# EAGLE design MSX OPL4 Wozblaster (EAGLE 6.1)
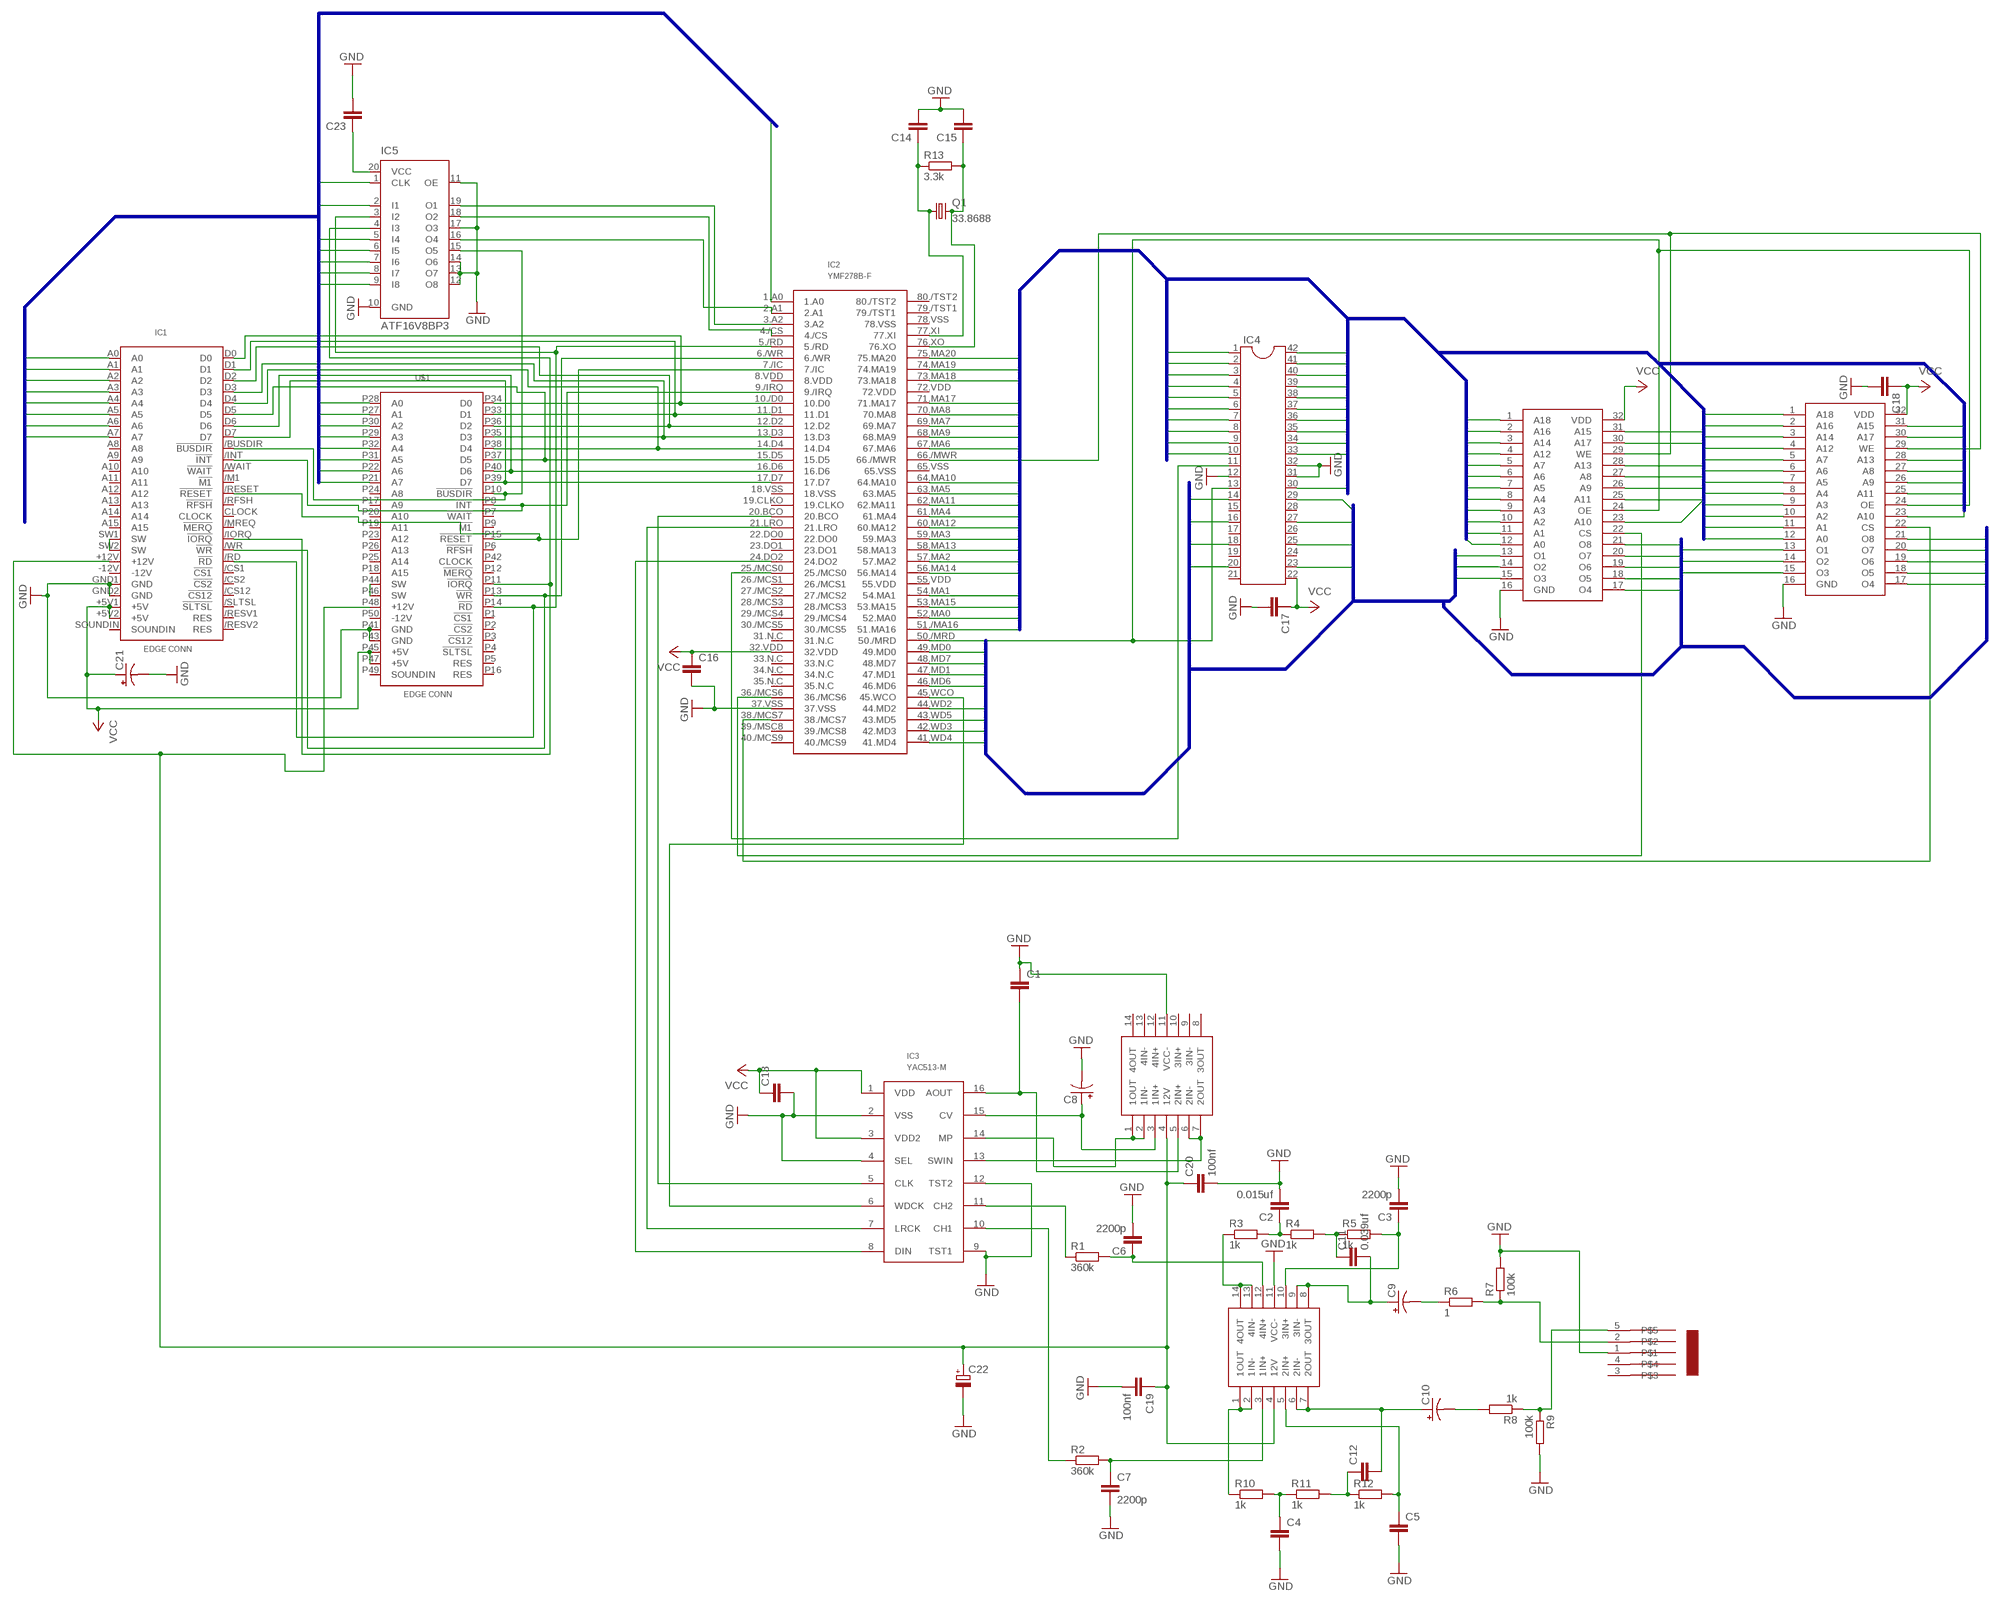
[diagram p0: schematic, sheet 1]

## Parts
C1  C2.5/2  [C2.5-2]
C2  0.015uf  C2.5/2  [C2.5-2]
C3  2200p  C2.5/2  [C2.5-2]
C4  C2.5/2  [C2.5-2]
C5  C2.5/2  [C2.5-2]
C6  2200p  C2.5/2  [C2.5-2]
C7  2200p  C2.5/2  [C2.5-2]
C8  CPOL-USE2.5-5  [E2,5-5]
C9  CPOL-USE2.5-5  [E2,5-5]
C10  CPOL-USE2.5-5  [E2,5-5]
C11  0.039uf  C2.5/2  [C2.5-2]
C12  C2.5/2  [C2.5-2]
C13  C2.5/2  [C2.5-2]
C14  C2.5/2  [C2.5-2]
C15  C2.5/2  [C2.5-2]
C16  C2.5/2  [C2.5-2]
C17  C2.5/2  [C2.5-2]
C18  C2.5/2  [C2.5-2]
C19  100nf  C2.5/2  [C2.5-2]
C20  100nf  C2.5/2  [C2.5-2]
C21  CPOL-USE2.5-5  [E2,5-5]
C22  CPOL-EUD/7343-31R  [D/7343-31R]
C23  C2.5/2  [C2.5-2]
IC1  OPL4_10X10  [OPL410X10]
IC2  YMF278B-F  [80-QFP]
IC3  YAC513-M  [16SOP]
IC4  DIL42  [DIL42]
IC5  ATF16V8BP3  [DIL20]
Q1  33.8688  CRYSTALHC49S  [HC49/S]
R1  360k  R-EU_0204/7  [0204/7]
R2  360k  R-EU_0204/7  [0204/7]
R3  1k  R-EU_0204/7  [0204/7]
R4  1k  R-EU_0204/7  [0204/7]
R5  1k  R-EU_0204/7  [0204/7]
R6  1  R-EU_0204/7  [0204/7]
R7  100k  R-EU_0204/7  [0204/7]
R8  1k  R-EU_0204/7  [0204/7]
R9  100k  R-EU_0204/7  [0204/7]
R10  1k  R-EU_0204/7  [0204/7]
R11  1k  R-EU_0204/7  [0204/7]
R12  1k  R-EU_0204/7  [0204/7]
R13  3.3k  R-EU_0204/7  [0204/7]
U$1  50PINCONN  [MSX50PINHEADER]
U$2  LF347SO14  [SO14-2]
U$3  LF347SO14  [SO14-2]
U$4  SRAM4MBIT  [SOP32L]
U$5  SRAM4MBIT  [SOP32L]
U$6  MSXJACK  [1501_06]

## Nets
+12V: C19.1 C20.1 C22.+ IC1.+12V U$1.P48(+12V) U$2.4(12V) U$3.4(12V)
A0: IC2.52.MA0 IC4.30(MA0) U$4.12(A0) U$5.12(A0)
A1: IC2.54.MA1 IC4.10(MA1) U$4.11(A1) U$5.11(A1)
A2: IC2.57.MA2 IC4.9(MA2) U$4.10(A2) U$5.10(A2)
A3: IC2.59.MA3 IC4.8(MA3) U$4.9(A3) U$5.9(A3)
A4: IC2.61.MA4 IC4.7(MA4) U$4.8(A4) U$5.8(A4)
A5: IC2.63.MA5 IC4.6(MA5) U$4.7(A5) U$5.7(A5)
A6: IC2.67.MA6 IC4.5(MA6) U$4.6(A6) U$5.6(A6)
A7: IC2.69.MA7 IC4.4(MA7) U$4.5(A7) U$5.5(A7)
A8: IC2.70.MA8 IC4.3(MA8) U$4.27(A8) U$5.27(A8)
A9: IC2.68.MA9 IC4.41(MA9) U$4.26(A9) U$5.26(A9)
A10: IC2.64.MA10 IC4.40(MA10) U$4.23(A10) U$5.23(A10)
A11: IC2.62.MA11 IC4.39(MA11) U$4.25(A11) U$5.25(A11)
A12: IC2.60.MA12 IC4.38(MA12) U$4.4(A12) U$5.4(A12)
A13: IC2.58.MA13 IC4.37(MA13) U$4.28(A13) U$5.28(A13)
A14: IC2.56.MA14 IC4.36(MA14) U$4.3(A14) U$5.3(A14)
A15: IC2.53.MA15 IC4.35(MA15) U$4.31(A15) U$5.31(A15)
A16: IC2.51./MA16(51.MA16) IC4.34(MA16) U$4.2(A16) U$5.2(A16)
A17: IC2.71.MA17 IC4.33(MA17) U$4.30(A17) U$5.30(A17)
A18: IC2.73.MA18 IC4.2(MA18) U$4.1(A18) U$5.1(A18)
A19: IC2.74.MA19 IC4.1(MA19)
A20: IC2.75.MA20 IC4.42(MA20)
AA0: IC1.A0 IC2.1.A0 U$1.P28(A0)
AA1: IC1.A1 IC5.9(I8) U$1.P27(A1)
AA2: IC1.A2 IC5.2(I1) U$1.P30(A2)
AA3: IC1.A3 IC5.7(I6) U$1.P29(A3)
AA4: IC1.A4 IC5.6(I5) U$1.P32(A4)
AA5: IC1.A5 IC5.5(I4) U$1.P31(A5)
AA6: IC1.A6 IC5.1(CLK) U$1.P22(A6)
AA7: IC1.A7 IC5.8(I7) U$1.P21(A7)
GND: C1.1 C2.2 C3.2 C4.2 C5.2 C6.2 C7.2 C8.- C13.2 C14.2 C15.2 C16.2 C17.2 C18.2 C19.2 C20.2 C21.- C22.- C23.2 IC1.GND1(GND) IC1.GND2(GND) IC2.37.VSS IC3.2(VSS) IC3.4(SEL) IC3.9(TST1) IC3.12(TST2) IC4.12(VSS) IC4.31(GND1) IC4.32(GND) IC5.10(GND) IC5.11(OE) IC5.12(O8) IC5.13(O7) IC5.14(O6) IC5.17(O3) R7.2 R9.2 U$1.P41(GND) U$1.P43(GND) U$2.11(VCC-) U$3.11(VCC-) U$4.16(GND) U$5.16(GND) U$6.1
MD0: IC2.49.MD0 IC4.14(MD0) U$4.13(O1) U$5.13(O1)
MD1: IC2.47.MD1 IC4.16(MD1) U$4.14(O2) U$5.14(O2)
MD2: IC2.44.WD2(44.MD2) IC4.18(MD2) U$4.15(O3) U$5.15(O3)
MD3: IC2.42.WD3(42.MD3) IC4.20(MD3) U$4.17(O4) U$5.17(O4)
MD4: IC2.41.WD4(41.MD4) IC4.23(MD4) U$4.18(O5) U$5.18(O5)
MD5: IC2.43.WD5(43.MD5) IC4.25(MD5) U$4.19(O6) U$5.19(O6)
MD6: IC2.46.MD6 IC4.27(MD6) U$4.20(O7) U$5.20(O7)
MD7: IC2.48.MD7 IC4.29(MD7) U$4.21(O8) U$5.21(O8)
N$1: IC1.D0 IC2.10./D0(10.D0) U$1.P34(D0)
N$2: IC1.D1 IC2.11.D1 U$1.P33(D1)
N$3: IC1.D2 IC2.12.D2 U$1.P36(D2)
N$4: IC1.D3 IC2.13.D3 U$1.P35(D3)
N$5: IC1.D4 IC2.14.D4 U$1.P38(D4)
N$6: IC1.D5 IC2.15.D5 U$1.P37(D5)
N$7: IC1.D6 IC2.16.D6 U$1.P40(D6)
N$8: IC1.D7 IC2.17.D7 U$1.P39(D7)
N$9: IC1./RD(!RD) IC2.5./RD IC5.3(I2) U$1.P14(!RD)
N$10: IC1./IORQ(!IORQ) IC5.4(I3) U$1.P11(!IORQ)
N$11: IC2.3.A2 IC5.19(O1)
N$12: IC2.4./CS IC5.18(O2)
N$13: IC2.2.A1 IC5.16(O4)
N$14: IC1./BUSDIR(!BUSDIR) IC5.15(O5) U$1.P10(!BUSDIR)
N$15: C1.2 IC3.16(AOUT) U$2.5(2IN+)
N$16: IC3.14(MP) U$2.1(1OUT) U$2.2(1IN-)
N$17: IC3.11(CH2) R1.1
N$18: C6.1 R1.2 U$3.12(4IN+)
N$19: R3.1 U$3.13(4IN-) U$3.14(4OUT)
N$20: C2.1 R3.2 R4.1
N$21: C11.1 R4.2 R5.1
N$22: C3.1 R5.2 U$3.10(3IN+)
N$23: C9.+ C11.2 U$3.8(3OUT) U$3.9(3IN-)
N$24: C10.- R8.2
N$25: R6.2 R7.1 U$6.2
N$26: C7.1 R2.2 U$3.3(1IN+)
N$27: R10.1 U$3.1(1OUT) U$3.2(1IN-)
N$28: C4.1 R10.2 R11.1
N$29: C12.1 R11.2 R12.1
N$30: C5.1 R12.2 U$3.5(2IN+)
N$31: C10.+ C12.2 U$3.6(2IN-) U$3.7(2OUT)
N$32: C9.- R6.1
N$33: R8.1 R9.1 U$6.5
N$34: IC3.10(CH1) R2.1
N$35: C8.+ IC3.15(CV) U$2.3(1IN+)
N$36: IC3.13(SWIN) U$2.6(2IN-) U$2.7(2OUT)
N$37: IC2.20.BCO IC3.5(CLK)
N$38: IC2.45.WCO IC3.6(WDCK)
N$39: IC2.21.LRO IC3.7(LRCK)
N$40: IC2.24.DO2 IC3.8(DIN)
N$41: C15.1 IC2.76.XO Q1.2 R13.2
N$42: C14.1 IC2.77.XI Q1.1 R13.1
N$43: IC2.25./MCS0 IC4.11(MCS0)
N$44: IC2.50./MRD IC4.13(MRD) U$4.24(OE) U$5.24(OE)
N$45: IC2.36./MCS6 U$4.22(CS)
N$46: IC2.38./MCS7 U$5.22(CS)
N$47: IC2.66./MWR U$4.29(WE) U$5.29(WE)
N$48: IC1.SW1(SW) IC1.SW2(SW)
N$49: U$1.P44(SW) U$1.P46(SW)
N$50: IC1./WR(!WR) IC2.6./WR U$1.P13(!WR)
N$51: IC1./INT(!INT) IC2.9./IRQ U$1.P8(!INT)
N$52: IC1./RESET(!RESET) IC2.7./IC U$1.P15(!RESET)
N$54: C23.1 IC5.20(VCC)
VCC: C13.1 C16.1 C17.1 C18.1 C21.+ IC1.+5V1(+5V) IC1.+5V2(+5V) IC2.32.VDD IC3.1(VDD) IC3.3(VDD2) IC4.22(VDD) U$1.P45(+5V) U$1.P47(+5V) U$4.32(VDD) U$5.32(VDD)
Unconnected: IC1.-12V IC1./CS1(!CS1) IC1./CS2(!CS2) IC1./CS12(!CS12) IC1./M1(!M1) IC1./MREQ(!MERQ) IC1./RESV1(RES) IC1./RESV2(RES) IC1./RFSH(!RFSH) IC1./SLTSL(!SLTSL) IC1./WAIT(!WAIT) IC1.A8 IC1.A9 IC1.A10 IC1.A11 IC1.A12 IC1.A13 IC1.A14 IC1.A15 IC1.CLOCK IC1.SOUNDIN IC2.8.VDD IC2.18.VSS IC2.19.CLKO IC2.22.DO0 IC2.23.DO1 IC2.26./MCS1 IC2.27./MCS2 IC2.28./MCS3 IC2.29./MCS4 IC2.30./MCS5 IC2.31.N.C IC2.33.N.C IC2.34.N.C IC2.35.N.C IC2.39./MSC8(39./MCS8) IC2.40./MCS9 IC2.55.VDD IC2.65.VSS IC2.72.VDD IC2.78.VSS IC2.79./TST1 IC2.80./TST2 IC4.15 IC4.17 IC4.19 IC4.21 IC4.24 IC4.26 IC4.28 U$1.P1(!CS1) U$1.P2(!CS2) U$1.P3(!CS12) U$1.P4(!SLTSL) U$1.P5(RES) U$1.P6(!RFSH) U$1.P7(!WAIT) U$1.P9(!M1) U$1.P12(!MERQ) U$1.P16(RES) U$1.P17(A9) U$1.P18(A15) U$1.P19(A11) U$1.P20(A10) U$1.P23(A12) U$1.P24(A8) U$1.P25(A14) U$1.P26(A13) U$1.P42(CLOCK) U$1.P49(SOUNDIN) U$1.P50(-12V) U$2.8(3OUT) U$2.9(3IN-) U$2.10(3IN+) U$2.12(4IN+) U$2.13(4IN-) U$2.14(4OUT) U$6.3 U$6.4

## Buses
A[0..20]
MD[0..7]
AA[0..15]

## Library data of the parts
C1-C7 C11-C20 C23 = capacitor-wima MSX:C: CAPACITOR naming: grid - package width
C8-C10 C21 = rcl:CPOL-US: POLARIZED CAPACITOR, American symbol
C22 = rcl:CPOL-EU: POLARIZED CAPACITOR, European symbol
IC1 = msx-con:OPL4_10X10
IC2 = Yamaha YMF278B-F:YMF278B-F: OPL4
IC3 = OPL4:YAC513-M
IC4 = ic-package OPL4 10x20:DIL42: Dual In Line
IC5 = atmel OPL4 10x20:ATF16V8B: High perfomance CMOS (electrically erasable) programmable logic device (PLD) ABLE-Atmel-ABEL - P18V8R, P16V8C, P16V8AS, P17V8 COPL Atmel-WinCUPL - G16V8MS, G16V8MA, G16V8AS, G16V8 LOG/IC - GAL16V8_R, GAL16V8_G7, GAL16V8_C), GAL16V8 Tango-PLD - G16V8R, G16V8C, G16V8AS, G16V8 Source: http://www.atmel.com/dyn/resources/prod_documents/DOC0364.PDF; MPN: ATF16V8CZ-15PU; OC_FARNELL: 1551768; OC_NEWARK: 94M6254
Q1 = crystal:CRYSTAL: CRYSTAL; OC_FARNELL: 1667008; OC_NEWARK: unknown
R1-R13 = resistor:R-EU_: RESISTOR, European symbol
U$1 = MSX-50 pin BUS HEADER:50PINCONN
U$2 U$3 = Texas LF347:LF347SO14
U$4 U$5 = ref-packages SRAM SO 32:SRAM4MBIT
U$6 = con-lumberg MSX:MSXJACK

## Board
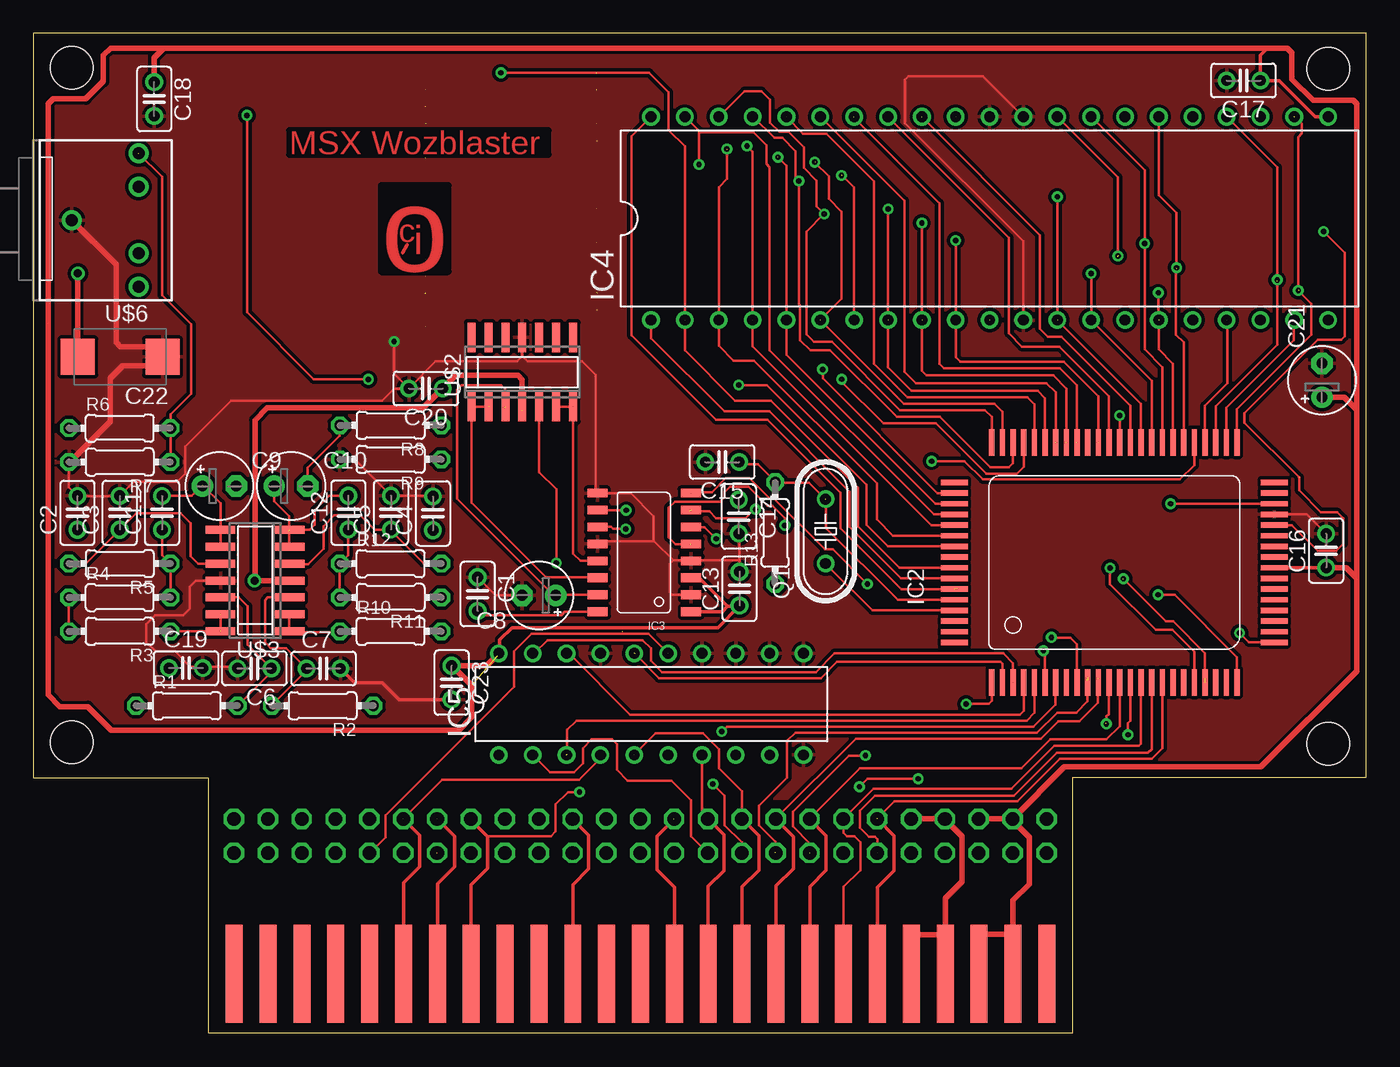
[diagram p1: board, top side]
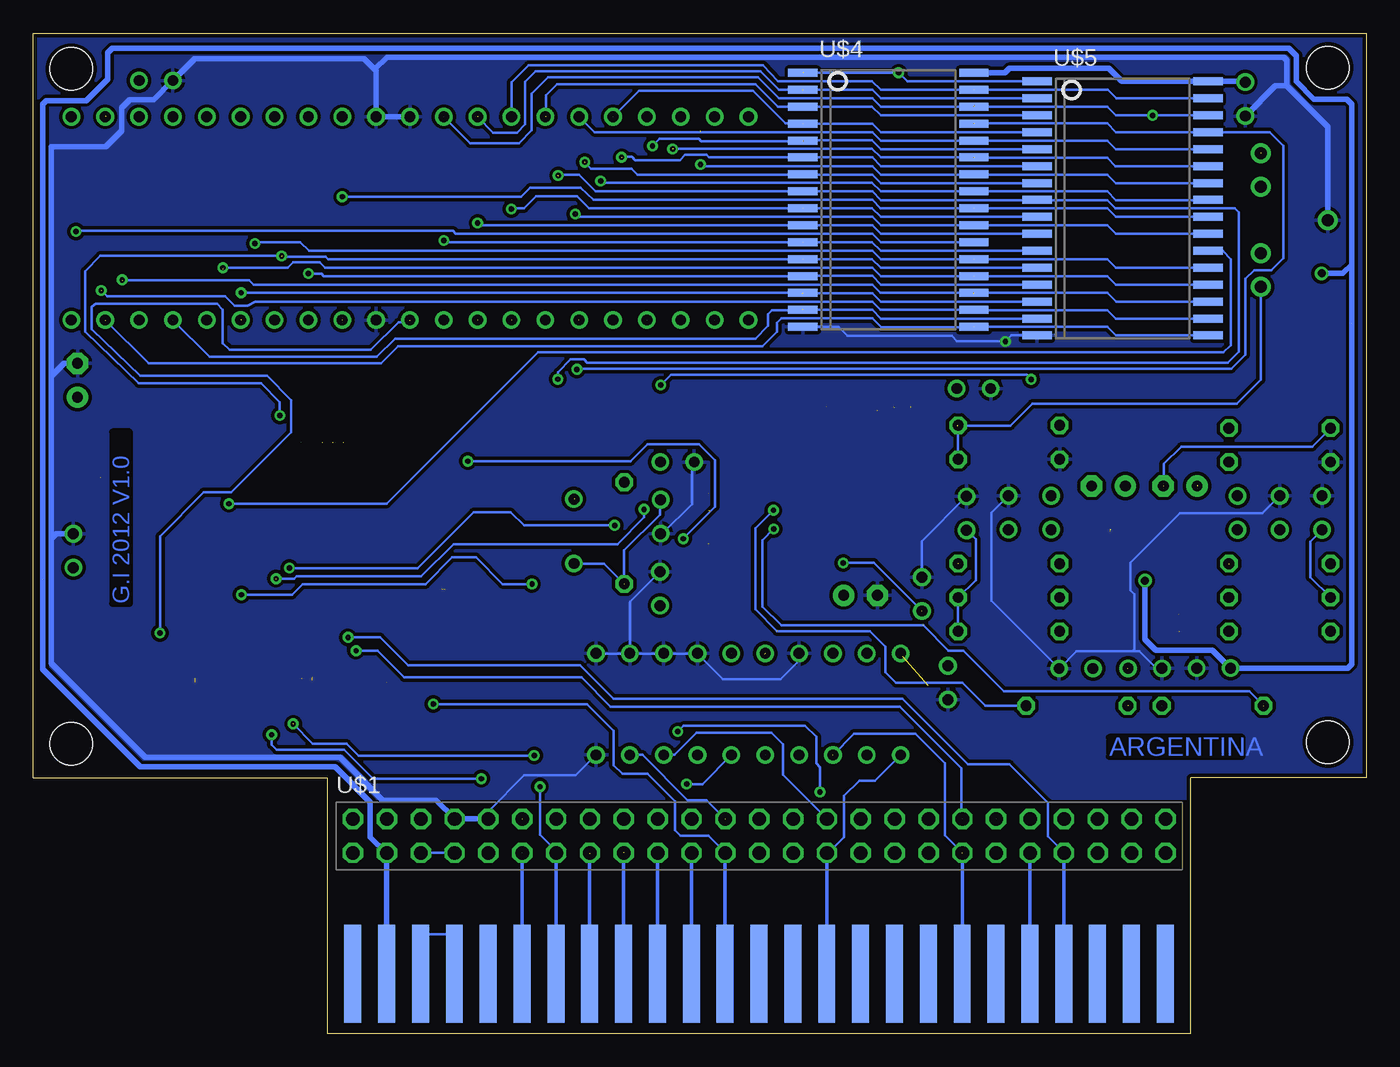
[diagram p2: board, bottom side, seen from below]

Size 100 x 75 mm. Coordinates in mm from the lower left corner, seen from the top.
Copper layers (1*16): Top 0.035mm / dielectric 1.5mm / Bottom 0.035mm
Design rules: minimum track width 0.2mm, minimum drill 0.29mm, track to track 8mil, track to pad 8mil, pad to pad 8mil, via to via 8mil, smd to smd 8mil, copper to edge 12mil, drill to drill 8mil, minimum pad ring 10mil, minimum via ring 8mil, stop-mask expansion 4mil, vias tented up to drill 0mil, thermal gap 10mil

### Footprints (pad centres in the part's own frame; a part is rotated, then mirrored left to right if it is on the bottom)
C2.5-2 = drill 0.813 pad 1.27: 1 -1.27,0; 2 1.27,0
E2,5-5 = drill 0.813 pad 1.6: + -1.27,0 | drill 0.813 pad 1.6 octagon: - 1.27,0
D/7343-31R = smd 2.55 x 2.7: + 3.175,0; - -3.175,0
OPL410X10 = smd 1.27 x 7.32 bottom: +5V1 -24.13,-32.362; +5V2 -21.59,-32.362; /CS1 34.29,-32.362; /CS12 31.75,-32.362; /IORQ 21.59,-32.362; /M1 24.13,-32.362; /RESET 16.51,-32.362; /RESV2 29.21,-32.362; /WAIT 26.67,-32.362; /WR 19.05,-32.362; A1 1.27,-32.362; A3 -1.27,-32.362; A5 -3.81,-32.362; A7 8.89,-32.362; A9 13.97,-32.362; A11 11.43,-32.362; A12 6.35,-32.362; A14 3.81,-32.362; D1 -6.35,-32.362; D3 -8.89,-32.362; D5 -11.43,-32.362; D7 -13.97,-32.362; GND1 -19.05,-32.362; GND2 -16.51,-32.362; SOUNDIN -26.67,-32.362 | smd 1.27 x 7.32: +12V -24.13,-32.362; -12V -26.67,-32.362; /BUSDIR 24.13,-32.362; /CS2 34.29,-32.362; /INT 26.67,-32.362; /MREQ 21.59,-32.362; /RD 19.05,-32.362; /RESV1 16.51,-32.362; /RFSH 29.21,-32.362; /SLTSL 31.75,-32.362; A0 1.27,-32.362; A2 -1.27,-32.362; A4 -3.81,-32.362; A6 8.89,-32.362; A8 6.35,-32.362; A10 11.43,-32.362; A13 3.81,-32.362; A15 13.97,-32.362; CLOCK -16.51,-32.362; D0 -6.35,-32.362; D2 -8.89,-32.362; D4 -11.43,-32.362; D6 -13.97,-32.362; SW1 -19.05,-32.362; SW2 -21.59,-32.362 | hole 3.2: -47.8,-15.1; 46.5,-15; -47.8,35.5; 46.5,35.6
80-QFP = smd 0.4 x 2: 1.A0 -9.1,-9.3; 2.A1 -8.3,-9.3; 3.A2 -7.5,-9.3; 4./CS -6.7,-9.3; 5./RD -5.9,-9.3; 6./WR -5.1,-9.3; 7./IC -4.3,-9.3; 8.VDD -3.5,-9.3; 9./IRQ -2.7,-9.3; 10./D0 -1.9,-9.3; 11.D1 -1.1,-9.3; 12.D2 -0.3,-9.3; 13.D3 0.5,-9.3; 14.D4 1.3,-9.3; 15.D5 2.1,-9.3; 16.D6 2.9,-9.3; 17.D7 3.7,-9.3; 18.VSS 4.5,-9.3; 19.CLKO 5.3,-9.3; 20.BCO 6.1,-9.3; 21.LRO 6.9,-9.3; 22.DO0 7.7,-9.3; 23.DO1 8.5,-9.3; 24.DO2 9.3,-9.3; 41.WD4 9.3,8.7; 42.WD3 8.5,8.7; 43.WD5 7.7,8.7; 44.WD2 6.9,8.7; 45.WCO 6.1,8.7; 46.MD6 5.3,8.7; 47.MD1 4.5,8.7; 48.MD7 3.7,8.7; 49.MD0 2.9,8.7; 50./MRD 2.1,8.7; 51./MA16 1.3,8.7; 52.MA0 0.5,8.7; 53.MA15 -0.3,8.7; 54.MA1 -1.1,8.7; 55.VDD -1.9,8.7; 56.MA14 -2.7,8.7; 57.MA2 -3.5,8.7; 58.MA13 -4.3,8.7; 59.MA3 -5.1,8.7; 60.MA12 -5.9,8.7; 61.MA4 -6.7,8.7; 62.MA11 -7.5,8.7; 63.MA5 -8.3,8.7; 64.MA10 -9.1,8.7 | smd 2 x 0.4: 25./MCS0 12.1,-6.3; 26./MCS1 12.1,-5.5; 27./MCS2 12.1,-4.7; 28./MCS3 12.1,-3.9; 29./MCS4 12.1,-3.1; 30./MCS5 12.1,-2.3; 31.N.C 12.1,-1.5; 32.VDD 12.1,-0.7; 33.N.C 12.1,0.1; 34.N.C 12.1,0.9; 35.N.C 12.1,1.7; 36./MCS6 12.1,2.5; 37.VSS 12.1,3.3; 38./MCS7 12.1,4.1; 39./MSC8 12.1,4.9; 40./MCS9 12.1,5.7; 65.VSS -11.9,5.7; 66./MWR -11.9,4.9; 67.MA6 -11.9,4.1; 68.MA9 -11.9,3.3; 69.MA7 -11.9,2.5; 70.MA8 -11.9,1.7; 71.MA17 -11.9,0.9; 72.VDD -11.9,0.1; 73.MA18 -11.9,-0.7; 74.MA19 -11.9,-1.5; 75.MA20 -11.9,-2.3; 76.XO -11.9,-3.1; 77.XI -11.9,-3.9; 78.VSS -11.9,-4.7; 79./TST1 -11.9,-5.5; 80./TST2 -11.9,-6.3
16SOP = smd 0.65 x 1.5: 1 0.2,-0.86; 2 1.47,-0.86; 3 2.74,-0.87; 4 4.01,-0.86; 5 5.28,-0.86; 6 6.55,-0.86; 7 7.82,-0.85; 8 9.09,-0.85; 9 9.09,6.17; 10 7.82,6.17; 11 6.55,6.16; 12 5.28,6.16; 13 4.01,6.16; 14 2.74,6.15; 15 1.47,6.15; 16 0.2,6.15
DIL42 = drill 0.813: 1 -25.4,-7.62; 2 -22.86,-7.62; 3 -20.32,-7.62; 4 -17.78,-7.62; 5 -15.24,-7.62; 6 -12.7,-7.62; 7 -10.16,-7.62; 8 -7.62,-7.62; 9 -5.08,-7.62; 10 -2.54,-7.62; 11 0,-7.62; 12 2.54,-7.62; 13 5.08,-7.62; 14 7.62,-7.62; 15 10.16,-7.62; 16 12.7,-7.62; 17 15.24,-7.62; 18 17.78,-7.62; 19 20.32,-7.62; 20 22.86,-7.62; 21 25.4,-7.62; 22 25.4,7.62; 23 22.86,7.62; 24 20.32,7.62; 25 17.78,7.62; 26 15.24,7.62; 27 12.7,7.62; 28 10.16,7.62; 29 7.62,7.62; 30 5.08,7.62; 31 2.54,7.62; 32 0,7.62; 33 -2.54,7.62; 34 -5.08,7.62; 35 -7.62,7.62; 36 -10.16,7.62; 37 -12.7,7.62; 38 -15.24,7.62; 39 -17.78,7.62; 40 -20.32,7.62; 41 -22.86,7.62; 42 -25.4,7.62
DIL20 = drill 0.813: 1 -11.43,-3.81; 2 -8.89,-3.81; 3 -6.35,-3.81; 4 -3.81,-3.81; 5 -1.27,-3.81; 6 1.27,-3.81; 7 3.81,-3.81; 8 6.35,-3.81; 9 8.89,-3.81; 10 11.43,-3.81; 11 11.43,3.81; 12 8.89,3.81; 13 6.35,3.81; 14 3.81,3.81; 15 1.27,3.81; 16 -1.27,3.81; 17 -3.81,3.81; 18 -6.35,3.81; 19 -8.89,3.81; 20 -11.43,3.81
HC49/S = drill 0.813: 1 -2.413,0; 2 2.413,0
0204/7 = drill 0.813 octagon: 1 -3.81,0; 2 3.81,0
MSX50PINHEADER = drill 1.016 octagon: P1 25.4,1.27; P2 25.4,-1.27; P3 22.86,1.27; P4 22.86,-1.27; P5 20.32,1.27; P6 20.32,-1.27; P7 17.78,1.27; P8 17.78,-1.27; P9 15.24,1.27; P10 15.24,-1.27; P11 12.7,1.27; P12 12.7,-1.27; P13 10.16,1.27; P14 10.16,-1.27; P15 7.62,1.27; P16 7.62,-1.27; P17 5.08,1.27; P18 5.08,-1.27; P19 2.54,1.27; P20 2.54,-1.27; P21 0,1.27; P22 0,-1.27; P23 -2.54,1.27; P24 -2.54,-1.27; P25 -5.08,1.27; P26 -5.08,-1.27; P27 -7.62,1.27; P28 -7.62,-1.27; P29 -10.16,1.27; P30 -10.16,-1.27; P31 -12.7,1.27; P32 -12.7,-1.27; P33 -15.24,1.27; P34 -15.24,-1.27; P35 -17.78,1.27; P36 -17.78,-1.27; P37 -20.32,1.27; P38 -20.32,-1.27; P39 -22.86,1.27; P40 -22.86,-1.27; P41 -25.4,1.27; P42 -25.4,-1.27; P43 -27.94,1.27; P44 -27.94,-1.27; P45 -30.48,1.27; P46 -30.48,-1.27; P47 -33.02,1.27; P48 -33.02,-1.27; P49 -35.56,1.27; P50 -35.56,-1.27
SO14-2 = smd 0.6 x 2.2: 1 -3.81,-2.6; 2 -2.54,-2.6; 3 -1.27,-2.6; 4 0,-2.6; 5 1.27,-2.6; 6 2.54,-2.6; 7 3.81,-2.6; 8 3.81,2.6; 9 2.54,2.6; 10 1.27,2.6; 11 0,2.6; 12 -1.27,2.6; 13 -2.54,2.6; 14 -3.81,2.6
SOP32L = smd 0.6 x 2.2: 1 -9.525,-6.416; 2 -8.255,-6.416; 3 -6.985,-6.416; 4 -5.715,-6.416; 5 -4.445,-6.416; 6 -3.175,-6.416; 7 -1.905,-6.416; 8 -0.635,-6.416; 9 0.635,-6.416; 10 1.905,-6.416; 11 3.175,-6.416; 12 4.445,-6.416; 13 5.715,-6.416; 14 6.985,-6.416; 15 8.255,-6.416; 16 9.525,-6.416; 17 9.525,6.416; 18 8.255,6.416; 19 6.985,6.416; 20 5.715,6.416; 21 4.445,6.416; 22 3.175,6.416; 23 1.905,6.416; 24 0.635,6.416; 25 -0.635,6.416; 26 -1.905,6.416; 27 -3.175,6.416; 28 -4.445,6.416; 29 -5.715,6.416; 30 -6.985,6.416; 31 -8.255,6.416; 32 -9.525,6.416
1501_06 = drill 0.9 pad 1.5: 1 0,-3; 2 5,-8; 3 2.5,-8; 4 -2.5,-8; 5 -5,-8

### Placement (x,y rotation side)
C1  33.34,32.94 270 top
C2  3.31,39.04 90 top
C3  6.48,39.04 90 top
C4  29.98,39 90 top
C5  26.84,39.05 90 top
C6  16.59,27.37 180 top
C7  21.77,27.36 0 top
C8  37.94,32.84 180 top
C9  13.96,41.05 0 top
C10  19.34,41.05 0 top
C11  9.66,39.04 90 top
C12  23.63,39.05 90 top
C13  52.98,33.35 90 top
C14  52.94,38.75 270 top
C15  51.69,42.85 180 top
C16  97,36.2 90 top
C17  90.8,71.46 180 top
C18  9.06,70.07 270 top
C19  11.45,27.39 0 top
C20  29.45,48.36 180 top
C21  96.69,48.98 90 top
C22  6.51,50.73 180 top
C23  31.38,26.3 270 top
IC1  49.37,36.83 0 bottom
IC2  81,35.62 0 top
IC3  48.49,31.43 90 top
IC4  71.75,61.12 0 top
IC5  46.35,24.69 0 top
Q1  59.44,37.65 90 top
R1  11.52,24.57 0 top
R2  21.7,24.57 180 top
R3  6.48,30.15 180 top
R4  6.48,32.69 0 top
R5  6.48,35.23 180 top
R6  6.48,45.39 0 top
R7  6.48,42.85 180 top
R8  26.8,45.6 180 top
R9  26.8,43.05 180 top
R10  26.8,30.15 0 top
R11  26.8,32.69 180 top
R12  26.8,35.23 0 top
R13  55.66,37.52 90 top
U$1  40.45,14.81 0 bottom
U$2  36.69,49.6 0 top
U$3  16.64,33.96 90 top
U$4  35.85,62.52 270 bottom
U$5  18.28,61.87 270 bottom
U$6  -0.11,61 90 top

### Tracks (layer width: path | path; a pad name or v marks a point on that pad's centre or on a via)
+12V  (via drill 0.6, 0.6 pad 0.81)  (2 unrouted)
  Top 0.203: C20.1 30.79,48.3 C20.1
  Top 0.406: U$2.4 36.69,46.74 | U$3.4 v16.59,33.95 16.63,33.99 16.63,46 17.54,46.91 29.25,46.91 C20.1 | C20.1 30.71,48.43 30.75,48.43 31.66,49.35 36.37,49.35 36.69,49.03 36.69,46.71 36.67,46.7 | C22.+ v3.34,56.98 v3.34,56.99
  Bottom 0.406: IC1.+12V 73.5,13.52 U$1.P48 73.55,13.54 74.72,14.72 74.72,17.35 77.36,19.99 91.98,19.99 99.28,27.29 99.28,69.68 | 1.09,57.65 1.09,69.69 1.47,70.07 3.91,70.07 5.23,71.39 5.23,73.32 5.79,73.88 94.09,73.88 94.44,73.54 94.44,71.56 96.03,69.96 99.02,69.96 99.28,69.69 | 1.09,57.65 1.09,27.68 1.37,27.4 C19.1 10.2,27.39 11.54,28.74 15.77,28.74 16.59,29.56 v16.59,33.95 | v3.34,56.99 1.75,56.99 1.09,57.65
A0  (via drill 0.4)  (4 unrouted)
  Top 0.2: IC2.52.MA0 v81.5,46.33 | v81.38,58.3 81.38,64.19 IC4.30
  Bottom 0.2: U$4.12 77.89,58.07 78.08,58.26 81.3,58.26 81.3,58.27 81.34,58.27 | v81.5,46.33 81.5,47.33 82.92,48.74 92.08,48.74 | 92.08,48.75 96.12,52.63 96.12,57.17 94.97,58.32 81.41,58.32 | U$5.12 36.41,57.42 37.06,58.07 U$4.12
A1  (via drill 0.4)  (2 unrouted)
  Top 0.2: v69.2,59.46 IC4.10 69.2,50.72 69.55,50.37 77.33,50.37 79.91,47.79 IC2.54.MA1 79.92,44.31
  Bottom 0.2: U$4.11 69.08,59.34 v69.2,59.46 | U$5.11 36.41,58.69 37.06,59.34 U$4.11
A2  (via drill 0.4)  (2 unrouted)
  Top 0.2: v66.67,60.77 IC4.9 | IC4.9 66.67,49.69 67.02,49.34 76.52,49.34 77.5,48.35 77.5,44.29
  Bottom 0.2: U$4.10 | U$5.10 36.41,59.96 37.05,60.61 U$4.10 | U$4.10 66.5,60.61 v66.67,60.77
A3  (via drill 0.4)  (2 unrouted)
  Top 0.2: v64.14,61.83 64.14,53.52 | IC4.8 64.12,49.96 65.89,48.19 75.36,48.19 75.91,47.64 IC2.59.MA3
  Bottom 0.2: 64.08,61.88 64.09,61.87 | 64.09,61.87 v64.14,61.83 | U$4.9 58.31,61.88 59.23,62.79 62.27,62.79 63.19,61.88 64.11,61.88 64.11,61.87 | 64.11,61.87 64.09,61.87 | 64.11,61.87 64.12,61.87 64.14,61.89 | U$5.9 36.41,61.23 37.06,61.88 U$4.9 42.3,61.84 42.28,61.84
A4  (via drill 0.4)  (3 unrouted)
  Top 0.2: IC4.7 61.58,63.44 60.66,64.36 | IC2.61.MA4 74.3,42.48 73.78,41.96 71.52,41.96 67.72,45.75 63.78,45.75 | v60.64,49.06 60.64,48.88 63.77,45.76 | 63.78,45.75 63.77,45.75 63.77,45.76 | 63.77,45.76 63.78,45.75
  Bottom 0.2: 60.56,64.39 v60.62,64.33 | U$5.8 | 60.66,64.34 60.62,64.39 59.08,64.39 57.84,63.15 U$4.8 37.05,63.15 36.41,62.5 U$5.8 | U$5.8 19.43,62.5 18.81,61.89 9.87,61.89 9.56,61.59 9.56,51.13 10.38,50.31 58.45,50.31 58.69,50.55 59.7,50.55 60.64,49.6 v60.64,49.05
A5  (via drill 0.4)  (3 unrouted)
  Top 0.2: IC4.6 65.33,47.21 72.11,47.21 72.7,46.61 IC2.63.MA5 | 58.66,65.36 58.66,65.29 59.67,64.27 59.67,62.58 60.63,61.62 60.63,55.1 59.05,53.52
  Bottom 0.2: U$4.7 37.05,64.41 36.41,63.77 U$5.7 | U$4.7 | U$4.7 54.69,64.41 55.12,64.85 58.14,64.85 58.64,65.35
  other vias: 58.62,65.34
A6  (via drill 0.4)  (2 unrouted)
  Top 0.2: v55.87,65.7 56.51,65.06 IC4.5 56.51,50.91 67.69,39.72 IC2.67.MA6
  Bottom 0.2: 55.84,65.7 55.84,65.71 | U$5.6 36.39,65.04 37.05,65.7 U$4.6 49.3,65.7 49.49,65.89 51.09,65.89 51.49,65.49 54.84,65.49 55.09,65.73 55.83,65.73 v55.85,65.7
A7  (via drill 0.4)  (2 unrouted)
  Top 0.2: IC2.69.MA7 67.38,38.12 53.95,51.54 IC4.4 53.95,53.5 | IC4.4 53.96,66.13 v53.55,66.55
  Bottom 0.2: U$4.5 37.08,66.97 36.41,66.31 U$5.5 | 42.21,66.95 42.24,66.92 49.89,66.92 50.06,67.09 53.01,67.09 v53.55,66.55
A8  (via drill 0.4)  (3 unrouted)
  Top 0.2: IC2.70.MA8 64.5,37.32 63.27,38.55 63.27,41.27 54.09,50.46 52.53,50.46 51.42,51.57 IC4.3 51.42,63.46 52.05,64.09 52.05,66.29 v52.02,66.32
  Bottom 0.2: 29.41,65.67 U$4.27 36.42,65.69 37.06,66.33 52.02,66.33 v52.03,66.31 | U$5.27 18.8,65.04 19.43,65.67 29.41,65.67
A9  (via drill 0.4)  (2 unrouted)
  Top 0.2: IC2.68.MA9 67.58,38.92 55.24,51.25 55.24,64.97 55.01,65.21 55.01,66.62 54.02,67.6 49.96,67.6 49.95,67.62 | v49.95,65.16 49.95,67.68 IC4.41
  Bottom 0.2: U$4.26 | U$5.26 18.79,63.77 19.43,64.41 U$4.26 | U$4.26 36.41,64.41 37.05,65.05 49.84,65.05 v49.95,65.16
A10  (via drill 0.4)  (1 unrouted)
  Top 0.2: IC4.40 53.35,70.67 54.63,70.67 55.27,70.03 55.27,68.31 55.96,67.62 56.66,67.62 57.83,66.45 57.83,64.9 58.77,63.96 58.77,62.03 v59.34,61.46 | IC2.64.MA10 71.91,46.25 71.41,46.75 65.03,46.75 59.91,51.87 58.55,51.87 57.99,52.43 57.99,60.11 v59.34,61.45
  Bottom 0.2: U$5.23 18.77,59.96 19.41,60.61 U$4.23 | U$4.23 | U$4.23 36.41,60.61 37.05,61.25 59.13,61.25 v59.34,61.45
A11  (via drill 0.4)
  Top 0.2: v57.44,63.92 v57.44,63.93 57.42,63.94 | IC4.39 54.01,68.74 55.59,67.15 56.21,67.15 57.2,66.17 57.2,64.16 v57.44,63.92 | v57.44,63.92 57.44,54.7 57.53,54.6 57.53,51.99 58.3,51.23 59.77,51.23 64.78,46.23 68.03,46.23 71.81,42.44 73.19,42.44 73.5,42.76 IC2.62.MA11
  Bottom 0.2: 57.48,63.96 v57.44,63.92 v57.44,63.91 v57.45,63.91 57.27,63.79 37.06,63.79 36.42,63.15 U$4.25 | U$5.25 18.77,62.5 19.41,63.15 U$4.25 | U$4.25 29.45,63.13
A12  (2 unrouted)
  Top 0.2: IC2.60.MA12 75.11,47.18 74.58,47.7 65.58,47.7 63.05,50.23 63.05,63.91 59.49,67.47 57.76,67.47 IC4.38
  Bottom 0.2: U$4.4 43.55,68.24 46.01,70.69 54.55,70.69 IC4.38 | U$4.4 37.05,68.23 36.41,67.58 U$5.4 | U$4.4 | U$4.4
A13  (1 unrouted)
  Top 0.2: IC4.37 65.34,62.44 65.34,49.62 66.2,48.76 76.02,48.76 76.7,48.07 IC2.58.MA13
  Bottom 0.2: U$5.28 18.79,66.31 19.43,66.96 U$4.28 36.41,66.96 37.05,67.6 57.91,67.6 IC4.37
A14  (2 unrouted)
  Top 0.2: 61.53,68.7 61.56,68.67 67.98,62.25 67.98,50.23 68.33,49.89 77.03,49.89 78.3,48.62 78.3,44.3 78.31,44.29
  Top 0.203: IC4.36 61.59,68.7 61.56,68.67
  Bottom 0.2: 61.51,68.7 61.53,68.73 61.53,70.35 60.7,71.19 45.81,71.19 44.12,69.5 U$4.3 37.06,69.5 36.41,68.85 U$5.3
A15  (1 unrouted)
  Top 0.2: IC2.53.MA15 80.7,47.78 76.98,51.5 74.19,51.5 73.19,52.5 73.19,59.68 IC4.35
  Bottom 0.2: IC4.35 64.12,71.32 62.84,72.6 45.27,72.6 44.12,71.41 37.08,71.41 36.41,70.78 29.47,70.78 29.46,70.77 U$4.31 | U$4.31 29.46,70.8 | U$5.31 18.75,70.12 19.39,70.77 U$4.31
A16  (3 unrouted)
  Top 0.2: IC2.51./MA16 82.3,47.08 77.14,52.25 76.14,52.25 75.53,52.85 75.53,59.85 66.73,68.65 66.64,68.75
  Top 0.203: 66.78,68.7 66.73,68.65
  Bottom 0.2: IC4.34 65.5,67.56 63.71,67.56 63.1,68.17 63.1,71.36 62.31,72.15 45.45,72.15 44.08,70.77 U$4.2 | U$5.2 36.39,70.12 37.05,70.78 42.24,70.78 42.27,70.75 42.27,70.79
A17  (via drill 0.4)  (3 unrouted)
  Top 0.2: IC2.71.MA17 64.14,36.52 62.52,38.14 62.52,41.13 55.02,48.62 v52.92,48.62 | v25.13,49.05 21.04,49.05 16.02,54.07 v16.02,68.85
  Bottom 0.2: IC4.33 67.25,66.77 63.56,66.77 62.62,67.72 62.62,70.47 61.38,71.71 45.63,71.71 44.08,70.13 37.05,70.13 36.42,69.5 U$4.30 29.41,69.52 | v52.92,48.62 v52.92,48.63 52.17,49.38 25.46,49.38 v25.13,49.05 | 29.41,69.52 29.41,69.53 | v16.02,68.85 U$5.30
  Bottom 0.203: v16.02,68.85 18.77,68.85 19.41,69.49 U$4.30 29.45,69.51
A18  (via drill 0.4)  (2 unrouted)
  Top 0.2: 48.94,53.45 IC4.2 | IC4.2 48.88,66.52 47.66,67.75 47.66,70.58 46.2,72.04 v35.09,72.04 | IC2.73.MA18 65,34.92 61.87,38.05 61.87,40.92 55.34,47.45 52.66,47.45 48.88,51.22 IC4.2 | 48.88,53.48 48.94,53.53 | IC4.2
  Top 0.203: IC4.2 48.98,53.5 48.94,53.45
  Bottom 0.2: U$4.1 | 42.23,72.04 v35.09,72.04 34.44,71.39 U$5.1
A19
  Top 0.2: IC2.74.MA19 65.08,34.12 61.23,37.98 61.23,40.63 55.21,46.64 51.84,46.64 46.34,52.14 IC4.1
A20  (1 unrouted)
  Top 0.2: IC4.42 44.89,67.29 44.89,52.35 51.23,46.02 55.06,46.02 60.55,40.53 60.55,37.88 65.12,33.31 69.45,33.31 69.47,33.32 69.39,33.32 69.36,33.35
AA0  (via drill 0.4)
  Top 0.2: IC2.1.A0 71.91,24.94 71.67,24.71 v69.98,24.71 v69.97,24.7
  Top 0.203: v69.98,24.7 v69.98,24.71
  Bottom 0.2: 48.19,13.7 48.2,13.7 49.34,14.83 51.45,14.83 51.84,15.22 51.84,17.41 53.91,19.47 55.8,19.47 56.45,20.12 56.45,22.68 58.48,24.7 v69.98,24.7
  Bottom 0.203: 48.19,13.7 U$1.P28 48.19,13.5 48.13,13.53
  Bottom 0.254: IC1.A0 48.09,13.49 48.13,13.53
  Bottom 0.4: 48.09,13.52 U$1.P28
AA1  (2 unrouted)
  Top 0.254: U$1.P27 48.05,16.09 48.03,16.08 48.02,16.08 | IC1.A1 48.09,10.95 46.78,12.26 46.78,14.78 48.05,16.05
  Bottom 0.2: IC5.9 54.3,20.88 50.91,17.5 49.49,17.5 48.05,16.06 48.08,16.06
AA2
  Top 0.2: U$1.P30 50.58,13.54 49.34,14.78 49.34,17.49 47.88,18.95 44.59,18.95 43.77,19.76 43.77,21.68 43.41,22.04 41.89,22.04 41.26,21.4 41.26,20.25 40.59,19.58 38.77,19.58 IC5.2
  Bottom 0.254: IC1.A2 50.63,13.52
  Bottom 0.4: 50.63,13.52 U$1.P30
AA3
  Top 0.203: IC5.7 50.19,20.7 50.19,16.5 50.59,16.1 U$1.P29
  Top 0.254: IC1.A3 50.63,11.02 51.81,12.2 51.81,14.88 U$1.P29
AA4  (via drill 0.4)
  Top 0.2: U$1.P32 53.16,14.32 51.85,15.62 51.85,17.83 v50.98,18.7
  Bottom 0.2: v50.98,18.7 49.8,18.7 IC5.6
  Bottom 0.254: IC1.A4 53.17,13.52 U$1.P32
AA5  (1 unrouted)
  Top 0.2: U$1.P31 53.16,18.17 51.44,19.89 51.44,21.32 50.26,22.5 46.7,22.5 IC5.5
  Top 0.254: IC1.A5 53.17,10.98 54.42,12.23 54.42,14.81 U$1.P31
AA6
  Bottom 0.2: U$1.P22 40.34,13.54 39.17,14.7 39.17,17.81 38.03,18.95 36.85,18.95 IC5.1
  Bottom 0.203: U$1.P22 40.59,13.5 40.48,13.5
  Bottom 0.254: IC1.A6 40.48,13.5 40.45,13.52
  Bottom 0.4: 40.48,13.52 U$1.P22
AA7
  Top 0.254: IC1.A7 40.48,11.14 41.66,12.33 41.66,14.87 U$1.P21
  Bottom 0.2: IC5.8 51.89,20.88 50.24,22.53 44.62,22.53 43.76,21.67 43.76,19.38 U$1.P21
GND  (via drill 0.4)
  Top 0.2: 12.58,27.5 11.79,27.5 10.63,28.65 9.18,28.65 8.48,29.35 8.48,30.7 9.13,31.35 11.23,31.35 11.73,31.85 11.73,33.5 12.18,33.95 13.54,33.95 | 49.19,35.5 48.05,35.5 48.02,35.47 | 48.02,35.47 47.77,35.22 47.77,33.09 47.95,32.9 49.17,32.9 49.19,32.89 | 46.59,36.9 48.02,35.47 | IC4.12 74.28,59.39 65.41,68.27 65.41,71.52 65.66,71.77 71.25,71.77 IC4.31 | v27.06,51.89 27.06,49.47 C20.2 | R7.2 2.67,40.95 C2.2 | C5.2 24.11,43.05 R9.2 | C5.2 | C5.2 29.93,40.32 C4.2 | 42.38,40.5 44.84,40.5 46.55,38.79 46.55,36.92 46.56,36.9 | C8.- 34.69,32.84 C1.1 | C20.2 27.09,48.36 26.18,47.45 14.85,47.45 11.4,44 11.4,41.98 10.79,41.37 7.54,41.37 C3.2 | IC2.37.VSS 95.55,38.92 C16.2 | C20.2 28.18,48.39 30.18,50.4 36.28,50.4 36.69,50.8 | 36.69,50.8 U$2.11 | 42.19,45.3 42.19,49.4 41.19,50.4 37.09,50.4 36.69,50.8
  Top 0.203: 52.98,35.5 52.98,37.3 C14.2 | 52.98,35.5 C13.2 | 49.19,35.5 IC3.4 49.38,35.5 52.98,35.5 | 42.38,40.5 IC3.9 42.19,40.7 42.19,45.3 | 46.59,36.9 46.56,36.9 42.38,36.9 IC3.12 | 13.38,33.9 13.58,33.9 | 13.58,33.9 13.98,33.9 U$3.11 13.58,33.9 | 12.58,27.5 C19.2 12.79,27.5 15.18,27.5 C6.2 | C2.2 3.38,40.3 6.38,40.3 C3.2 | 13.58,33.9 13.54,33.95 | IC3.2 49.19,32.9 49.17,32.9
  Top 0.254: C23.2 27.45,25.03 26.18,26.3 24.1,26.3 C7.2
  Top 0.406: U$1.P43 U$1.P41 68.36,16.08 69.67,14.77 69.67,11.36 68.44,10.13 68.44,3.83 IC1.GND1 68.42,7.01 68.05,7.38 65.88,7.38 IC1.GND2 | R7.2 2.74,42.84 5.76,45.86 5.76,49.12 6.71,50.07 9.21,50.07 9.29,50.15 9.29,51.48 9.32,51.51 6.52,51.51 6.21,51.82 6.21,57.68 U$6.1
  Bottom 0.2: U$5.16 26.61,52.34 v27.06,51.89 | U$4.16 39.6,52.99 38.92,52.31 31.09,52.31 30.7,51.91 27.11,51.91 27.07,51.87 | C1.1 33.34,36.92 C4.2 | U$1.P41 65.86,16.67 63.16,19.36 59.3,19.36 IC5.10
  Bottom 0.203: C15.2 50.59,42.7 50.59,39.7 52.78,37.5 C14.2 | 22.98,27.5 C7.2 | C3.2 7.79,39 13.98,39 17.68,35.3 17.68,33.25 17.38,32.95 17.38,28.8 17.54,28.65 | C6.2 15.75,27.37 17.04,28.65 17.54,28.65 | 17.54,28.65 21.73,28.65 C7.2 | C5.2 28.11,39.04 28.11,32.43 23.02,27.34 | 57.8,28.48 55.24,28.48 | 55.24,28.48 50.19,28.48 50.19,28.49 | 55.24,28.48 55.24,32.36 C13.2 | 42.59,28.48 42.59,27.92 43.94,26.57 48.27,26.57 50.16,28.46
  Bottom 0.4: IC4.32 IC4.31 74.28,72.2 74.38,72.3 | 74.38,72.3 75.19,73.1 | 98.66,66.49 94.58,66.5 93.39,67.7 | 74.38,72.3 73.45,73.22 6.17,73.22 5.95,73 5.95,71.06 6.8,71.06 C18.2
  Bottom 0.406: U$1.P41 68.36,16.08 69.78,17.5 73.78,17.5 76.98,20.7 91.61,20.7 98.66,27.75 98.66,37.11 | 98.66,37.11 98.66,49.28 | 98.66,49.28 98.66,66.49 | 93.39,67.7 93.39,69.42 92.78,70.02 90.98,70.02 C17.2 | 75.19,73.1 87.92,73.1 87.92,73.06 C17.2 | C16.2 98.3,37.47 98.66,37.11 | C21.- 97.67,50.26 98.66,49.28 | U$6.1 2.89,68 5.95,71.06
  pour Top (isolate 0.254): 0.23,19.33 0.16,19.33 0.16,74.83 99.83,74.83 99.83,19.29 77.81,19.29 77.78,17.6 13.3,17.56 13.33,19.33 0.55,19.33 0.55,19.34
  pour Bottom (isolate 0.254): 0.14,19.32 0.13,19.32 0.13,74.85 99.88,74.85 99.88,19.28 77.78,19.28 77.78,17.6 13.31,17.56 13.31,19.28 0.41,19.28 0.41,19.29
MD0  (via drill 0.4)
  Top 0.2: IC2.49.MD0 83.91,48.96 IC4.14 | v79.36,56.98 79.36,53.52 | 79.36,53.52 IC4.14 | IC4.14 79.36,53.52
  Bottom 0.2: U$5.13 36.39,56.15 37.05,56.81 U$4.13 78.2,56.8 78.39,56.98 v79.36,56.98 v79.38,56.99
MD1  (via drill 0.4)  (2 unrouted)
  Top 0.2: IC2.47.MD1 85.5,50.23 84.44,51.3 84.44,53.45 84.48,53.5 | v84.41,55.54 84.41,53.53 84.42,53.51
  Top 0.203: IC4.16 84.39,53.5 84.44,53.45
  Bottom 0.2: U$4.14 v84.39,55.53 v84.41,55.54 | 42.34,55.52 37.05,55.52 36.41,54.88 U$5.14
MD2  (2 unrouted)
  Top 0.2: IC2.44.WD2 87.91,47.07 89.58,48.75 89.58,53.44 IC4.18
  Bottom 0.2: 43.12,54.26 U$4.15 37.05,54.26 36.41,53.61 U$5.15 | IC4.18 86.77,50.73 74.23,50.73 72.86,52.11 45.83,52.11 44.88,53.06 44.88,53.94 44.59,54.22 42.37,54.22 42.3,54.28
MD3  (2 unrouted)
  Top 0.2: IC2.42.WD3 89.5,46.91 94.58,51.99 94.58,53.42
  Top 0.203: IC4.20 94.58,53.5 94.58,53.42
  Bottom 0.2: 94.55,53.46 91.34,50.25 73.89,50.25 72.61,51.53 45.3,51.53 44.2,52.62 44.2,53.29 43.88,53.63 37.05,53.63 36.38,52.95 29.45,52.95 29.41,52.98 19.43,52.98 18.79,52.34 U$5.17
MD4  (via drill 0.4)  (2 unrouted)
  Top 0.2: IC2.41.WD4 90.3,46.8 95.89,52.38 95.89,54.73 v94.91,55.71 | v94.91,55.71 v94.89,55.72 | v94.91,55.71 94.91,67.22 95.19,67.5 95.19,68.2 94.58,68.8
  Bottom 0.2: 94.92,55.72 94.47,55.27 85.61,55.27 84.91,54.57 83.92,54.57 83.34,54.88 37.05,54.88 36.44,54.26 U$4.18 29.41,54.23 19.41,54.23 18.79,53.61 U$5.18
MD5  (via drill 0.4)  (2 unrouted)
  Top 0.2: IC2.43.WD5 88.7,47.02 93.31,51.63 93.31,56.44 | 89.52,68.76 89.58,68.69 93.33,64.95 v93.33,56.51 93.33,56.47 93.3,56.44
  Top 0.203: IC4.25 89.58,68.7 89.58,68.69
  Bottom 0.2: v93.33,56.51 93.3,56.49 83.8,56.49 83.47,56.15 37.05,56.15 36.44,55.53 U$4.19 | U$5.19 18.75,54.88 19.41,55.53 29.38,55.53 29.43,55.48
MD6  (via drill 0.4)  (3 unrouted)
  Top 0.2: 85.75,57.42 85.73,57.41 85.73,57.31 85.78,57.35 v85.78,57.42 85.73,57.38 85.73,52.41 86.3,51.84 IC2.46.MD6 | IC4.27 84.44,62.87 85.75,61.56 85.75,57.35 85.77,57.35
  Bottom 0.2: v85.78,57.42 v85.77,57.41 85.75,57.43 | U$5.20 18.77,56.15 19.41,56.79 U$4.20 | U$4.20 36.42,56.8 37.05,57.43 78.11,57.43 78.52,57.84 80.5,57.84 80.92,57.42 85.72,57.42 85.73,57.44
MD7  (via drill 0.4)  (1 unrouted)
  Top 0.2: IC2.48.MD7 84.7,49.96 83.38,51.29 v83.38,59.23 83.38,64.73 IC4.29
  Bottom 0.2: v83.38,59.23 83.28,59.33 79.97,59.33 79.33,58.71 37.05,58.71 36.41,58.07 U$4.21 | U$5.21 18.77,57.42 19.41,58.07 U$4.21 29.45,58.09
N$1  (4 unrouted)
  Top 0.2: 55.7,13.59 55.67,13.61 55.67,14.38 54.45,15.6 54.45,17.07 56.55,19.16 56.55,21.93 57.16,22.55 75.3,22.55 76.81,24.06 78.25,24.06 79.08,24.89 79.08,26.71 79.11,26.73 | 79.08,26.6 79.11,26.63 | 79.09,26.48 79.08,26.49
  Top 0.203: 79.08,26.54 79.11,26.57 | 79.11,26.57 79.08,26.57 | IC2.10./D0 79.19,26.5 79.11,26.57
  Bottom 0.254: IC1.D0 55.71,13.52 U$1.P34
N$2  (1 unrouted)
  Top 0.2: U$1.P33 61.71,22.1 75.58,22.1 76.91,23.42 78.5,23.42 79.88,24.8 79.88,26.63
  Top 0.203: 55.98,15.9 U$1.P33 | 79.88,26.59 IC2.11.D1
  Top 0.254: IC1.D1 55.71,11.06 57.02,12.36 57.02,14.76 U$1.P33
N$3  (via drill 0.4)  (2 unrouted)
  Top 0.2: v62.42,20.83 61.19,20.83 56.98,16.62 56.98,15.52 58.28,14.21 58.28,13.55 58.24,13.51 | 80.67,26.59 80.67,23.93 80.52,23.77 80.52,23.29 80.47,23.25
  Top 0.203: 80.67,26.59 IC2.12.D2
  Bottom 0.2: v62.42,20.83 75.58,20.83 76.48,21.73 79.03,21.73 v80.5,23.21
  Bottom 0.254: IC1.D2 58.26,13.52 U$1.P36
N$4
  Top 0.2: U$1.P35 62.02,19.87 74.11,19.87 76.3,22.05 80.5,22.05 81.5,23.05 IC2.13.D3
  Top 0.254: IC1.D3 58.26,11.01 59.48,12.24 59.48,14.83 U$1.P35 58.2,16.08
N$5  (via drill 0.4)  (1 unrouted)
  Top 0.2: IC2.14.D4 82.3,23.43 82.14,23.26 v82.14,22.4 82.14,22.4
  Top 0.203: v66.39,19.1 62.59,19.1 v61.98,18.5
  Bottom 0.2: v66.39,19.1 74.5,19.1 76.67,21.27 81.75,21.27 82.14,21.65 v82.14,22.39 v82.12,22.4
  Bottom 0.203: v61.98,18.5 61.98,14.9 60.78,13.7 U$1.P38
  Bottom 0.254: IC1.D4 60.8,13.52
  Bottom 0.4: 60.8,13.52 U$1.P38
N$6
  Top 0.2: IC2.15.D5 83.11,21.72 82.95,21.57 76.61,21.57 73.36,18.33 63.02,18.33 U$1.P37
  Top 0.203: IC1.D5 60.8,10.98 62.05,12.23 62.05,14.34 61.62,14.77 61.03,14.77 60.77,15.03 U$1.P37
N$7  (1 unrouted)
  Top 0.2: IC2.16.D6 83.91,21.31 83.64,21.04 76.78,21.04 73.58,17.83 63.16,17.83 62.02,16.69
  Top 0.203: 62.02,16.69 62.02,15.42 62.69,14.75 63.13,14.75 63.31,14.57 63.31,13.56 U$1.P40
  Bottom 0.254: IC1.D6 63.34,13.52
  Bottom 0.4: 63.34,13.52 U$1.P40
N$8  (1 unrouted)
  Top 0.2: IC2.17.D7 84.7,21.38 83.91,20.58 77.02,20.58 73.84,17.41 64.61,17.41 63.3,16.1 | 63.3,16.1 63.3,16.09 U$1.P39 63.3,16.1 | 63.3,16.1 63.28,16.1
  Top 0.203: 63.78,15.7 U$1.P39
  Top 0.254: IC1.D7 63.34,10.96 64.58,12.2 64.58,14.82 U$1.P39
N$9  (4 unrouted)
  Top 0.2: 75.08,26.51 75.11,26.53 | 40.02,20.88 40.05,20.91 40.05,22.76 40.74,23.45 74.53,23.45 75.11,24.03 75.11,26.5
  Top 0.203: 75.08,26.63 75.11,26.61 75.11,26.53 75.11,26.5 75.19,26.5 IC2.5./RD
  Bottom 0.2: 38.42,22.46 IC5.3
  Bottom 0.203: 38.42,22.46 33.83,22.46 31.61,20.24 31.61,14.85 U$1.P14
  Bottom 0.254: IC1./RD 30.29,3.96 30.29,13.52
N$10  (1 unrouted)
  Top 0.2: IC5.4 42.55,20.64 40.94,19.03 30.68,19.03 27.73,16.09 U$1.P11
  Top 0.254: IC1./IORQ 27.77,11.29 28.97,12.49 28.97,14.86 U$1.P11
N$11  (1 unrouted)
  Top 0.2: 45.38,29.5 45.71,29.5 46.34,28.87 46.34,27.94 47.19,27.1 58.73,27.1 60.12,28.49 72.77,28.49 73.5,27.75 73.5,26.34 73.53,26.32
  Top 0.203: 45.38,29.5 38.59,29.5 37.59,28.5 IC5.19
N$12
  Top 0.2: 44.78,23.9 74.02,23.9 74.3,24.19 IC2.4./CS
  Top 0.203: 44.78,23.9 40.19,28.5 IC5.18 | 74.33,26.64 74.3,26.66 | 74.33,26.64 IC2.4./CS | 74.39,26.7 74.33,26.64
N$13  (1 unrouted)
  Top 0.2: 45.14,28.45 46.95,26.65 59.09,26.65 60.3,27.86 72.55,27.86 72.7,27.71 IC2.2.A1
N$14  (1 unrouted)
  Top 0.2: 45.59,29.96 46.16,29.96 IC5.15 | 37.39,29.96 36.09,28.65 36.09,26 26.45,16.36 26.45,14.72 25.27,13.54 U$1.P10
  Top 0.203: 37.39,29.96 45.59,29.96
  Bottom 0.254: IC1./BUSDIR 25.23,13.52
  Bottom 0.4: 25.23,13.52 U$1.P10
N$15  (via drill 0.4)  (1 unrouted)
  Top 0.2: U$2.5 37.95,42.1 39.24,40.81 v39.24,35.28 | IC3.16 39.87,31.62 39.62,31.37 33.63,31.37 C1.2
  Bottom 0.2: v39.24,35.28 36.92,35.28 C1.2
N$16  (1 unrouted)
  Top 0.2: IC3.14 42.3,34.2 38.45,34.2 32.88,39.78 U$2.1 34.19,47 34.2,47.02 34.21,47.02
N$17  (via drill 0.4)  (2 unrouted)
  Top 0.2: v44.45,37.83 43.48,37.83 43.34,37.98 IC3.11
  Bottom 0.2: 33.26,30.6 43.88,30.6 45.3,32.01 45.3,36.99 v44.45,37.83
  Bottom 0.203: 33.23,30.6 31.34,28.7 30.23,28.7 27.18,25.65 8.79,25.65 R1.1
N$18  (2 unrouted)
  Top 0.2: U$3.12 15.39,32.69 16.06,32.02 16.06,29.16 C6.1
  Top 0.203: C6.1 17.86,27.13 15.31,24.58
N$19  (2 unrouted)
  Top 0.2: R3.1 U$3.14 14.06,30.18 14.06,31.43
N$20
  Top 0.2: R3.2 R4.1
  Bottom 0.2: C2.1 4.2,36.87 4.2,34.22 R4.1
N$21  (1 unrouted)
  Top 0.2: R4.2 R5.1 | C11.1 9.66,35.85 R5.1
N$22
  Top 0.2: R5.2 3.94,35.23 C3.1 7.71,39 11.04,39 11.79,38.25 11.79,35.79 12.35,35.23 U$3.10
N$23  (1 unrouted)
  Top 0.2: U$3.9 U$3.8 | U$3.8 14.04,37.84 13.98,37.9 | U$3.8 14.04,39.74 12.68,41.1 11.89,40.31 C11.2
  Top 0.203: 13.98,37.7 U$3.8
N$24
  Top 0.2: R8.2 23,44.82 20.59,42.41 20.59,41.07 C10.-
N$25  (1 unrouted)
  Top 0.2: R7.1 R6.2 10.29,46.44 11.83,47.98 11.83,53.19 9.65,55.37 9.65,64.23 U$6.2
N$26  (1 unrouted)
  Top 0.2: U$3.3 17.59,32.69 17.38,32.48 17.38,29.32 17.81,28.88 18.98,28.88 C7.1 20.5,27.34
  Top 0.203: 20.5,27.34 20.5,27.23 17.84,24.57
N$27
  Top 0.203: U$3.2 19.18,31.3 19.18,30.3 U$3.1 19.38,30.1 22.98,30.1 R10.1
N$28
  Bottom 0.2: R10.2 R11.1 30.59,32.69 29.29,33.99 29.29,37.04 C4.1
N$29
  Top 0.2: C12.1 23.63,35.87 R12.1
  Top 0.203: R11.2 22.98,35.1 R12.1
N$30  (1 unrouted)
  Top 0.2: 19.18,35.25 19.23,35.2 20.63,35.2 21.79,36.35 21.79,38.05 22.59,38.85 24.54,38.85 25.61,37.78 C5.1 26.84,37.7 29.29,35.24 R12.2
  Top 0.203: U$3.5 19.18,35.3 19.18,35.25
N$31  (2 unrouted)
  Top 0.2: C12.2 22.18,40.32 21.11,39.25 21.11,38.15 20.73,37.78 19.18,37.78 19.16,37.8 | C10.+ 18.06,39.91 19.18,38.79 19.18,37.65 19.25,37.59
  Top 0.203: U$3.6 19.18,36.5 19.18,37.7 U$3.7
N$32  (1 unrouted)
  Bottom 0.2: R6.1 4.05,44.01 13.88,44.01 15.17,42.71 15.17,41.1 C9.-
N$33  (2 unrouted)
  Bottom 0.2: U$6.5 7.89,49.02 9.7,47.22 25.04,47.22 26.68,45.58 30.68,45.58 | R9.1 R8.1
N$34  (via drill 0.4)  (1 unrouted)
  Top 0.2: IC3.10 44.46,39.24 v44.48,39.23
  Bottom 0.2: 44.2,30.16 45.84,31.8 45.84,37.87 v44.48,39.23
  Bottom 0.203: 44.19,30.15 37.23,30.15 36.09,29 36.09,27.1 35.28,26.3 30.29,26.3 28.55,24.57 R2.1
N$35  (1 unrouted)
  Top 0.2: IC3.15 39.26,32.9 C8.+ 39.03,32.84 31.79,40.09 31.79,48.27 32.12,48.6 35.08,48.6 35.38,48.29 35.38,46.92 35.41,46.9 | 35.41,46.55 U$2.3
N$36  (1 unrouted)
  Top 0.2: IC3.13 41.05,35.43 40.49,35.98 40.48,35.98 U$2.7 | U$2.6 U$2.7
N$37  (via drill 0.4)  (1 unrouted)
  Top 0.2: 49.27,36.69 49.3,36.72 | v56.39,38.11 56.38,38.13 v56.38,38.1 56.38,38.64 55.45,39.57 55.06,39.57 53.64,40.99 52.26,40.99 51.84,40.58 51.84,40.2 51.52,39.88 48.14,39.88 47.66,39.41 47.66,37.19 48.16,36.69 49.3,36.69 49.31,36.68 | IC2.20.BCO 87.11,28.61 85.45,30.26 84.22,30.26 80.78,33.69 v80.78,34.9
  Top 0.203: 49.19,36.9 IC3.5 49.38,36.7 49.3,36.72
  Bottom 0.2: 63.19,38.1 v56.38,38.1
  Bottom 0.203: 63.19,38.1 64.19,39.1 66.98,39.1 71.19,34.9 v80.78,34.9
N$38  (via drill 0.4)
  Top 0.2: v51.24,37.1 v51.23,37.1 50.37,37.97 IC3.6 | 87.09,44.03 IC2.45.WCO 87.11,42.61 86.03,41.54 71.23,41.54 69.86,42.91 v67.39,42.91
  Bottom 0.2: v67.39,42.91 55.2,42.91 53.91,44.2 50.08,44.2 48.85,42.98 48.85,39.49 v51.24,37.1
N$39  (via drill 0.4)  (3 unrouted)
  Top 0.2: v81.78,34.09 v81.8,34.09 84.98,30.9 85.53,30.9 87.91,28.52 87.91,26.63 87.89,26.62
  Top 0.203: 49.38,39.1 IC3.7 | 81.77,34.1 v81.78,34.09 v81.78,34.1 | v54.19,39.3 54.09,39.3 53.44,38.65 51.23,38.65 50.73,39.15 49.23,39.15
  Bottom 0.2: 56.19,36.7 68.47,36.7 70.89,34.27 80.25,34.27 80.42,34.1 81.75,34.1 81.78,34.07 81.77,34.07
  Bottom 0.203: v54.19,39.3 54.19,38.7 56.19,36.7
N$40  (via drill 0.4)  (1 unrouted)
  Top 0.2: 59.38,36.3 55.56,40.11 55.27,40.11 53.74,41.63 51.95,41.63 50.91,40.59 49.42,40.59 49.34,40.5 | IC2.24.DO2 90.3,28.22 85.64,32.89 v84.39,32.89 v84.39,32.9
  Top 0.203: 59.38,36.3 59.98,36.3 v62.59,33.7
  Bottom 0.203: v62.59,33.7 64.78,33.7 66.78,35.7 68.58,35.7 70.58,33.7 79.78,33.7 80.58,32.9 v84.39,32.9
N$41  (1 unrouted)
  Top 0.2: IC2.76.XO 64.86,32.52 59.48,37.9 59.48,40.02 Q1.2
  Top 0.203: C15.1 52.98,42.7 54.38,42.7 55.59,41.5 R13.2 55.78,41.3 58.19,41.3 59.38,40.1
N$42  (1 unrouted)
  Top 0.2: IC2.77.XI 62.96,31.72 Q1.1
  Bottom 0.2: Q1.1 57.19,35.24 R13.1 55.66,36.22 52.98,38.9
  Bottom 0.203: 52.98,38.9 52.98,39.9 C14.1
N$43  (via drill 0.4)  (1 unrouted)
  Top 0.2: IC2.25./MCS0 91.2,29.32 v90.5,30.03
  Bottom 0.2: v90.5,30.03 90.5,37.29 87.2,40.58 85.16,40.58 80.64,45.09 80.64,47.48 82.47,49.31 91.98,49.31 95.62,52.82 95.62,54.51 95.33,54.71 86.2,54.71 85.78,54.28 85.78,51.77 85.27,51.26 74.69,51.26 72.61,53.35 71.92,53.35 71.78,53.49
N$44  (via drill 0.4)  (2 unrouted)
  Top 0.2: IC2.50./MRD 83.11,47.22 IC4.13 | v76.83,62.74 IC4.13 76.8,53.48
  Bottom 0.2: U$5.24 18.77,61.23 19.43,61.88 29.09,61.88 | 29.09,61.88 U$4.24 36.44,61.89 37.05,62.51 57.95,62.51 58.95,63.42 62.73,63.42 63.41,62.74 v76.83,62.74 | 29.09,61.88 29.06,61.85
N$45  (via drill 0.4)  (1 unrouted)
  Top 0.2: IC2.36./MCS6 92.81,38.11 94.42,38.11 96.36,36.18 97.75,36.18 98.28,36.71 98.28,38.62 97.81,39.09 96.59,39.09 94.97,40.72 94.97,41.68 94.94,41.71 | 94.97,41.69 90.86,45.8 90.86,46.51 96.36,52.01 98.11,52.01 98.41,52.3 98.41,58.53 v96.8,60.14
  Bottom 0.2: v96.8,60.14 96.72,60.21 68.52,60.21 68.31,59.98 37.05,59.98 36.41,59.34 U$4.22
N$46  (via drill 0.4)  (1 unrouted)
  Top 0.2: v85.33,39.72 IC2.38./MCS7
  Bottom 0.2: U$5.22 10.77,58.69 10.15,58.07 10.15,51.62 10.71,51.07 62.12,51.07 73.48,39.71 v85.33,39.71
N$47  (via drill 0.4)  (1 unrouted)
  Top 0.2: IC2.66./MWR 67.84,40.52 59.23,49.14 59.23,50.05 v59.21,49.8
  Bottom 0.2: U$4.29 | v59.21,49.8 59.19,49.83 10.13,49.83 9.05,50.91 9.05,56.59 8.39,57.25 7.13,57.25 6.23,58.15 6.23,66.58 7.23,67.58 U$5.29 18.77,67.58 19.43,68.24 U$4.29
N$48
  Bottom 0.2: IC1.SW2 70.95,7.15 70.66,7.45 68.86,7.45 68.77,7.35 68.77,4.16 IC1.SW1
N$49
  Bottom 0.2: U$1.P46 U$1.P44
N$50  (via drill 0.4)  (1 unrouted)
  Top 0.203: IC2.6./WR 75.91,28.6 v75.8,28.71 | v75.8,28.71 75.78,28.72 | v75.78,28.7 v75.8,28.71
  Top 0.254: IC1./WR 30.31,11.21 31.59,12.49 31.59,14.78 U$1.P13
  Bottom 0.203: v75.78,28.7 74.19,28.7 72.19,26.7 58.88,26.7 56.69,24.5 34.98,24.5 30.38,19.9 30.38,16.2 30.29,16.1 | 30.38,16.1 U$1.P13
N$51  (via drill 0.4)  (1 unrouted)
  Top 0.203: IC2.9./IRQ 78.3,29.17 77.8,29.67 76.42,29.67 | 76.42,29.67 76.42,29.68 | v76.39,29.7 76.42,29.67
  Bottom 0.2: 22.79,13.7 22.81,13.7 | v76.38,29.69 v76.39,29.7 | 76.36,29.66 v76.39,29.69
  Bottom 0.203: 22.79,13.7 U$1.P8 | 22.81,13.7 22.81,13.73 23.88,14.8 23.88,17.3 26.79,20.2 29.88,20.2 34.78,25.1 56.48,25.1 58.98,27.6 71.89,27.6 73.98,29.7 v76.39,29.7
  Bottom 0.254: IC1./INT 22.7,13.52
  Bottom 0.4: 22.7,13.52 U$1.P8
N$52  (via drill 0.4)
  Top 0.2: 76.66,26.59 76.67,26.58 76.67,24.63 75.05,23.01 52.03,23.01 v51.66,22.63 | v40.98,18.1 40.1,18.1 39.2,17.19 39.2,15.15 38.83,14.78 34.13,14.78 34.09,14.74
  Top 0.203: 76.67,26.58 IC2.7./IC 76.78,26.7
  Top 0.254: IC1./RESET 32.85,11.14 34.09,12.38 34.09,14.74 32.84,16 U$1.P15
  Bottom 0.2: v40.98,18.1 40.98,19.97 41.26,20.24 41.26,22.24 42.09,23.08 51.2,23.08 v51.66,22.63
N$53
  Top 0.254: 28.04,59.13 27.7,58.53
N$54
  Top 0.406: C23.1 33.99,27.57 IC5.20
VCC  (3 unrouted)
  Top 0.2: C13.1 52.98,32.06
  Top 0.203: C13.1 52.98,32.1 52.95,32.08 | C18.1 9.18,71.3 9.06,71.37 | 94.22,73.74 94.19,73.7 94.08,73.88
  Top 0.254: IC3.1 51.69,31.62 52.09,32.03 | 52.09,32.03 52.94,32.03 C13.1 | IC3.3 49.96,34.16 52.09,32.03 | IC4.22 96.19,68.74 93.5,71.44 92.08,71.44 C17.1 92.06,73.36 92.58,73.88 | 52.98,32.06 51.35,30.43 35.91,30.43 34.99,29.52 34.99,28.51 34.98,28.5 34.78,28.3 | IC2.32.VDD C16.1
  Top 0.4: 5.79,73.88 9.79,73.88 9.06,73.16 9.06,71.37 | 1.1,26.41 1.1,25.38 1.98,24.5 4.08,24.5 5.83,22.75 31.84,22.75
  Top 0.406: IC1.+5V2 70.97,3.82 70.97,7.38 71,7.42 73.12,7.42 73.5,7.05 IC1.+5V1 73.5,9.97 74.72,11.2 74.72,14.7 73.34,16.08 U$1.P45 U$1.P47 73.47,16.1 77.36,19.98 92.09,19.98 99.28,27.17 99.28,34.07 | C16.1 98.5,34.93 99.28,34.14 | 94.12,73.84 94.08,73.88 92.58,73.88 9.79,73.88 | 5.79,73.88 5.25,73.34 5.25,71.39 3.94,70.08 1.47,70.08 1.1,69.71 1.1,53.27 | 1.1,53.26 1.1,26.41 | 94.14,73.83 94.22,73.74 94.44,73.53 94.44,71.57 96.03,69.97 99.03,69.97 99.28,69.71 99.28,46.77 | 99.28,46.77 99.28,34.14 | 99.28,34.14 99.28,34.04 | C21.+ 98.34,47.71 99.28,46.77 | 31.84,22.75 31.93,22.75 32.88,23.7 32.88,26.1 31.38,27.6
  Bottom 0.4: U$5.32 9.12,71.39 C18.1
  Bottom 0.406: U$4.32 27.11,72.03 26.77,72.37 19.31,72.37 18.34,71.39 U$5.32

### Text on the board
Top: MSX Wozblaster | c | i | o
Bottom: G.I 2012 V1.0 | ARGENTINA
Document: c17 | MSX - OPL4 - FM & Wave Table Synthesizer Sound Cartridge | c18 | R-CH | 27C160 | L-CH | c22 | c19 | LF347 | c21 | 1K | 1K | c10 | c9 | 100K | 100K | c2/3/11 | c15 | c14 | c4/5/12 | c1 | c8 | 3.3K | YMF278B-F | 1K | 1K | LF347 | YAC513-M | c16 | 1K | 1K | c13 | 1K | 1K | c20 | c6 | c7 | c23 | GAL16V8D | 360 | 360
bDocu: MSX - Wozblaster V1.0 Rev.1 | KM684000ALG | KM684000ALG | 16Mbit SAMPLE ROM - Up to 8Mbit SRAM | Non commercial project | 1 | +5v | 49 | 2 | +12v | 50 | Talent / Daewoo MSX 50-PIN Expansion BUS